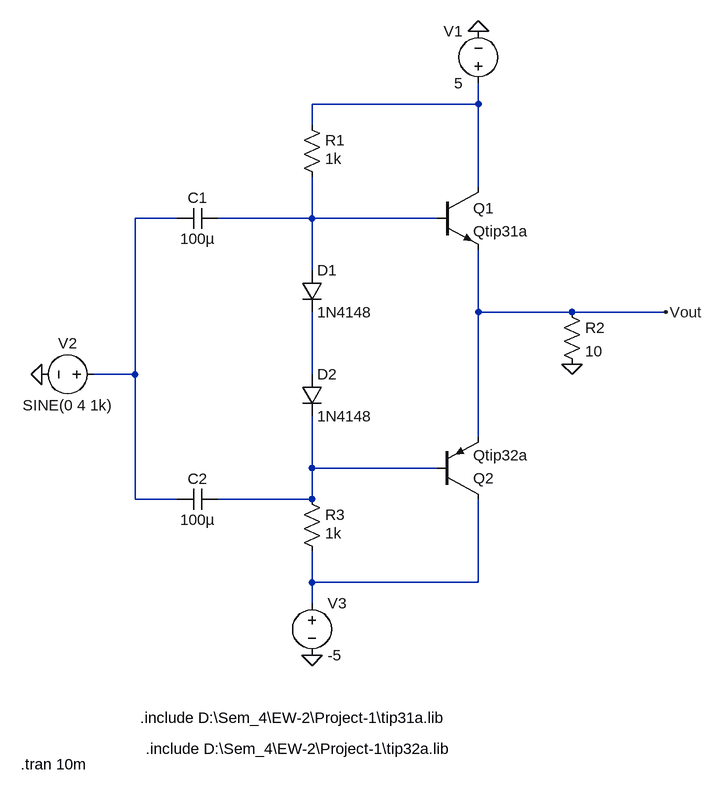
[diagram p0: schematic power_amplifier.asc]
power_amplifier.asc, the LTspice schematic file:
Version 4
SHEET 1 952 680
WIRE 592 -784 592 -816
WIRE 592 -784 336 -784
WIRE 336 -752 336 -784
WIRE 592 -656 592 -784
WIRE 128 -608 64 -608
WIRE 336 -608 336 -672
WIRE 336 -608 192 -608
WIRE 528 -608 336 -608
WIRE 336 -528 336 -608
WIRE 592 -464 592 -560
WIRE 736 -464 592 -464
WIRE 880 -464 736 -464
WIRE 64 -368 64 -608
WIRE 64 -368 0 -368
WIRE 336 -368 336 -464
WIRE 592 -272 592 -464
WIRE 336 -224 336 -304
WIRE 528 -224 336 -224
WIRE 64 -176 64 -368
WIRE 128 -176 64 -176
WIRE 336 -176 336 -224
WIRE 336 -176 192 -176
WIRE 336 -48 336 -96
WIRE 592 -48 592 -176
WIRE 592 -48 336 -48
WIRE 336 -16 336 -48
FLAG 592 -896 0
FLAG 880 -464 Vout
FLAG 736 -384 0
FLAG -80 -368 0
FLAG 336 64 0
SYMBOL npn 528 -656 R0
SYMATTR InstName Q1
SYMATTR Value Qtip31a
SYMBOL voltage 592 -800 R180
WINDOW 0 24 96 Left 2
WINDOW 3 24 16 Left 2
WINDOW 123 0 0 Left 0
WINDOW 39 0 0 Left 0
SYMATTR InstName V1
SYMATTR Value 5
SYMBOL res 320 -768 R0
WINDOW 3 36 68 Left 2
SYMATTR Value 1k
SYMATTR InstName R1
SYMBOL res 720 -480 R0
SYMATTR InstName R2
SYMATTR Value 10
SYMBOL voltage 16 -368 R90
WINDOW 0 -32 56 VBottom 2
WINDOW 3 32 56 VTop 2
WINDOW 123 0 0 Left 0
WINDOW 39 0 0 Left 0
SYMATTR InstName V2
SYMATTR Value SINE(0 4 1k)
SYMBOL cap 192 -624 R90
WINDOW 0 0 32 VBottom 2
WINDOW 3 32 32 VTop 2
SYMATTR InstName C1
SYMATTR Value 100µ
SYMBOL cap 192 -192 R90
WINDOW 0 0 32 VBottom 2
WINDOW 3 32 32 VTop 2
SYMATTR InstName C2
SYMATTR Value 100µ
SYMBOL res 320 -192 R0
WINDOW 3 36 68 Left 2
SYMATTR Value 1k
SYMATTR InstName R3
SYMBOL voltage 336 -32 R0
WINDOW 123 0 0 Left 0
WINDOW 39 0 0 Left 0
SYMATTR InstName V3
SYMATTR Value -5
SYMBOL pnp 528 -176 M180
SYMATTR InstName Q2
SYMATTR Value Qtip32a
SYMBOL diode 320 -528 R0
SYMATTR InstName D1
SYMATTR Value 1N4148
SYMBOL diode 320 -368 R0
SYMATTR InstName D2
SYMATTR Value 1N4148
TEXT 72 160 Left 2 !.include D:\\Sem_4\\EW-2\\Project-1\\tip31a.lib
TEXT 80 208 Left 2 !.include D:\\Sem_4\\EW-2\\Project-1\\tip32a.lib
TEXT -112 232 Left 2 !.tran 10m

The netlist it stands for:
* power_amplifier.asc
Q1 N001 N003 Vout 0 Qtip31a
V1 N001 0 5
R1 N001 N003 1k
R2 Vout 0 10
V2 N002 0 SINE(0 4 1k)
C1 N003 N002 100µ
C2 N005 N002 100µ
R3 N005 N006 1k
V3 N006 0 -5
Q2 N006 N005 Vout 0 Qtip32a
D1 N003 N004 1N4148
D2 N004 N005 1N4148
.model D D
.lib standard.dio
.model NPN NPN
.model PNP PNP
.lib standard.bjt
.include D:\Sem_4\EW-2\Project-1\tip31a.lib
.include D:\Sem_4\EW-2\Project-1\tip32a.lib
.tran 10m
.backanno
.end